# EAGLE design robot (EAGLE 6.5.0)
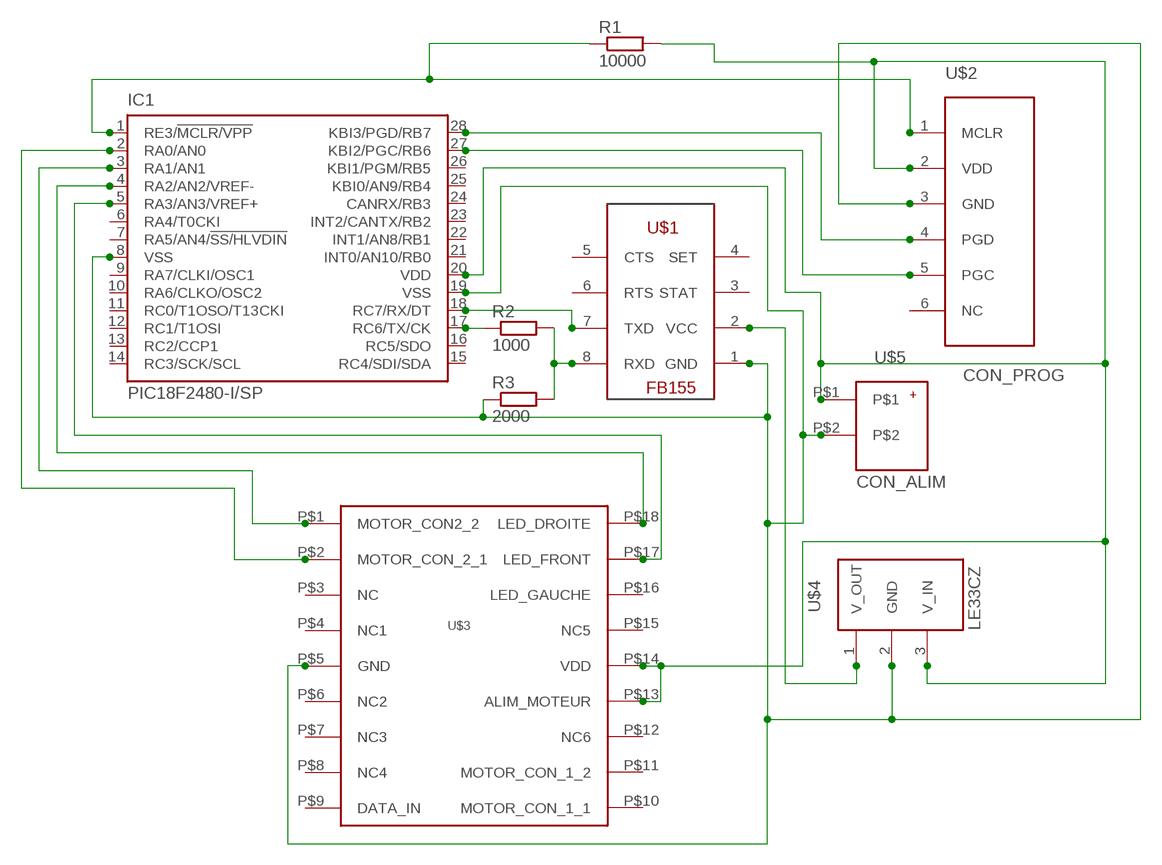
[diagram p0: schematic, sheet 1]

## Parts
IC1  PIC18F2480-I/SP  [DIL28-3]
R1  10000  R-EU_0207/7  [0207/7]
R2  1000  R-EU_0207/7  [0207/7]
R3  2000  R-EU_0207/7  [0207/7]
U$1  FB155  [DIL8L]
U$2  CON_PROG  [CON_PROG]
U$3  ROBOT  [CON_ROBOT]
U$4  LE33CZ  [T092]
U$5  CON_ALIM  [CON_ALIM]

## Nets
N$1: IC1.2(RA0/AN0) U$3.P$2(MOTOR_CON_2_1)
N$2: IC1.3(RA1/AN1) U$3.P$1(MOTOR_CON2_2)
N$3: IC1.4(RA2/AN2/VREF-) U$3.P$18(LED_DROITE)
N$4: IC1.5(RA3/AN3/VREF+) U$3.P$17(LED_FRONT)
N$5: IC1.28(KBI3/PGD/RB7) U$2.4(PGD)
N$6: IC1.27(KBI2/PGC/RB6) U$2.5(PGC)
N$7: IC1.17(RC6/TX/CK) R2.1
N$8: R2.2 R3.2 U$1.8(RXD)
N$9: U$1.2(VCC) U$4.1(V_OUT)
N$10: IC1.1(RE3/!MCLR/VPP) R1.1 U$2.1(MCLR)
N$11: IC1.8(VSS) IC1.19(VSS) R3.1 U$1.1(GND) U$2.3(GND) U$3.P$5(GND) U$4.2(GND) U$5.P$2
N$12: IC1.18(RC7/RX/DT) U$1.7(TXD)
N$15: IC1.20(VDD) R1.2 U$2.2(VDD) U$3.P$13(ALIM_MOTEUR) U$3.P$14(VDD) U$4.3(V_IN) U$5.P$1
Unconnected: IC1.6(RA4/T0CKI) IC1.7(RA5/AN4/!SS/HLVDIN) IC1.9(RA7/CLKI/OSC1) IC1.10(RA6/CLKO/OSC2) IC1.11(RC0/T1OSO/T13CKI) IC1.12(RC1/T1OSI) IC1.13(RC2/CCP1) IC1.14(RC3/SCK/SCL) IC1.15(RC4/SDI/SDA) IC1.16(RC5/SDO) IC1.21(INT0/AN10/RB0) IC1.22(INT1/AN8/RB1) IC1.23(INT2/CANTX/RB2) IC1.24(CANRX/RB3) IC1.25(KBI0/AN9/RB4) IC1.26(KBI1/PGM/RB5) U$1.3(STAT) U$1.4(SET) U$1.5(CTS) U$1.6(RTS) U$2.6(NC) U$3.P$3(NC) U$3.P$4(NC1) U$3.P$6(NC2) U$3.P$7(NC3) U$3.P$8(NC4) U$3.P$9(DATA_IN) U$3.P$10(MOTOR_CON_1_1) U$3.P$11(MOTOR_CON_1_2) U$3.P$12(NC6) U$3.P$15(NC5) U$3.P$16(LED_GAUCHE)

## Library data of the parts
IC1 = microchip:PIC18F2*80: 28-Pin Enhanced Flash Microcontrollers with ECAN(TM) Technology 10-Bit A/D and nanoWatt Technology Source: http://www.microchip.com .. 39637a.pdf; MF: MICROCHIP; MPN: PIC18F2480-I/SP; OC_FARNELL: 9321217; OC_NEWARK: 71J7237
R1-R3 = resistor:R-EU_: RESISTOR, European symbol
U$1 = FB155:FB155
U$2 = con_prog:CON_PROG
U$3 = robot:ROBOT
U$4 = regul:LE33CZ
U$5 = con_alim:CON_ALIM

## Board
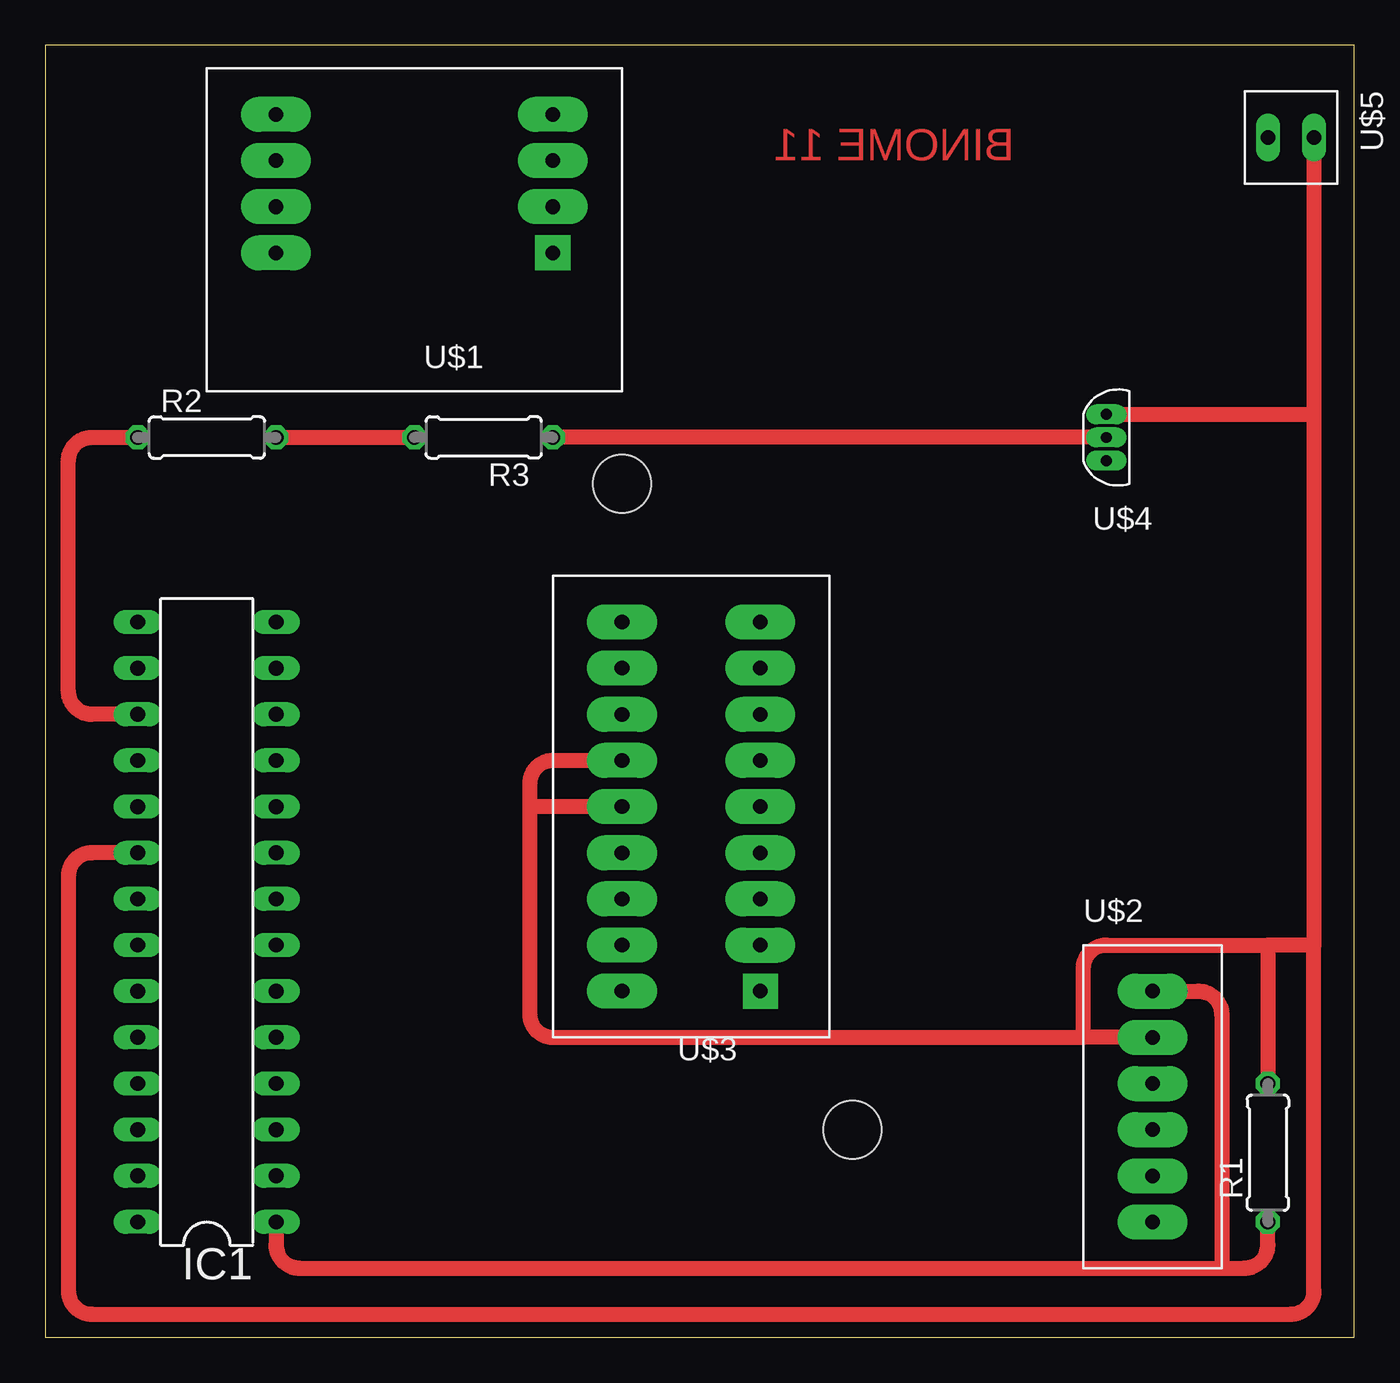
[diagram p1: board, top side]
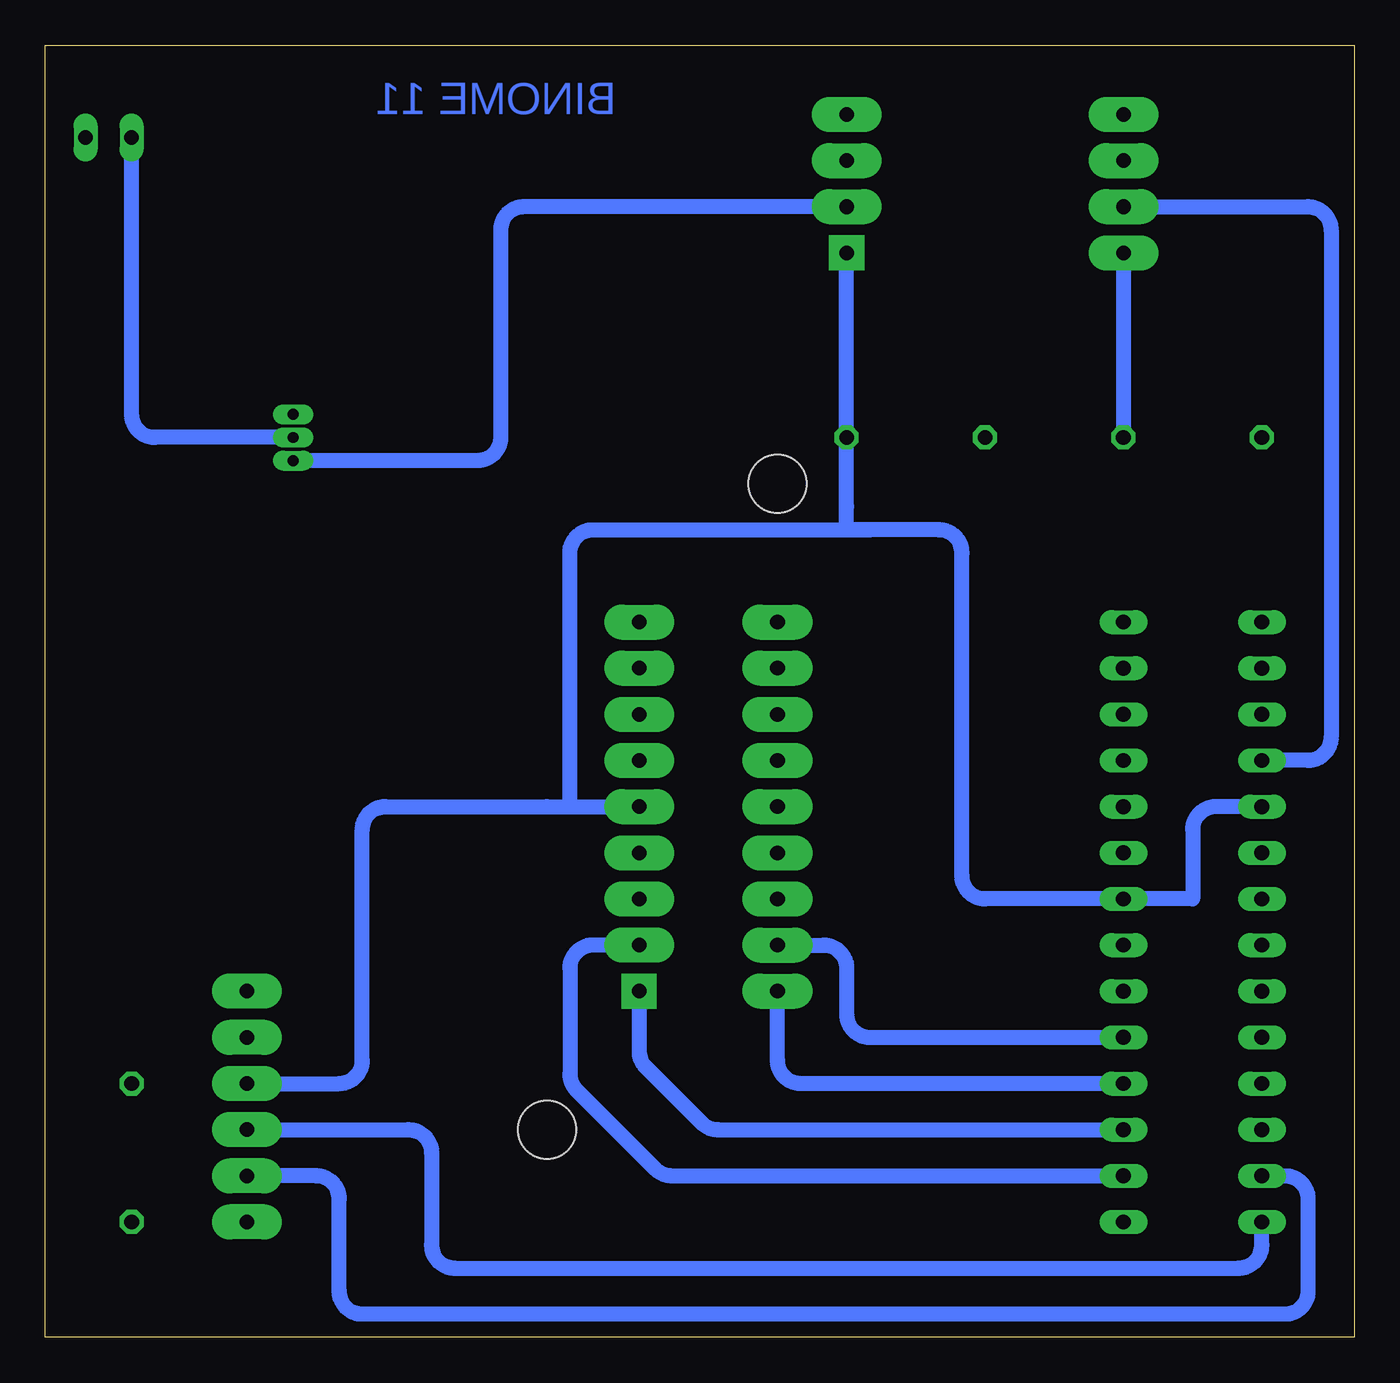
[diagram p2: board, bottom side, seen from below]

Size 72.06 x 71.11 mm. Coordinates in mm from the lower left corner, seen from the top.
Outline: 0,0 72.06,0 72.06,71.11 0,71.11 0,0
Copper layers (1*16): Top 0.035mm / dielectric 1.5mm / Bottom 0.035mm
Design rules "default": minimum track width 10mil, minimum drill 24mil, track to track 8mil, track to pad 8mil, pad to pad 8mil, via to via 8mil, smd to smd 8mil, copper to edge 40mil, drill to drill 8mil, minimum pad ring 10mil, minimum via ring 8mil, stop-mask expansion 4mil, vias tented up to drill 0mil, thermal gap 10mil
Holes 3.2 mm at 31.75,46.99 44.45,11.43

### Footprints (pad centres in the part's own frame; a part is rotated, then mirrored left to right if it is on the bottom)
DIL28-3 = drill 0.813 long: 1 -16.51,-3.81; 2 -13.97,-3.81; 3 -11.43,-3.81; 4 -8.89,-3.81; 5 -6.35,-3.81; 6 -3.81,-3.81; 7 -1.27,-3.81; 8 1.27,-3.81; 9 3.81,-3.81; 10 6.35,-3.81; 11 8.89,-3.81; 12 11.43,-3.81; 13 13.97,-3.81; 14 16.51,-3.81; 15 16.51,3.81; 16 13.97,3.81; 17 11.43,3.81; 18 8.89,3.81; 19 6.35,3.81; 20 3.81,3.81; 21 1.27,3.81; 22 -1.27,3.81; 23 -3.81,3.81; 24 -6.35,3.81; 25 -8.89,3.81; 26 -11.43,3.81; 27 -13.97,3.81; 28 -16.51,3.81
0207/7 = drill 0.813 octagon: 1 -3.81,0; 2 3.81,0
DIL8L = drill 0.8 pad 1.93 square: 1 -6.35,5.08 | drill 0.8 pad 1.93 long: 2 -6.35,2.54; 3 -6.35,0; 4 -6.35,-2.54; 5 8.89,-2.54; 6 8.89,0; 7 8.89,2.54; 8 8.89,5.08
CON_PROG = drill 0.8 pad 1.93 long: 1 1.27,3.81; 2 1.27,1.27; 3 1.27,-1.27; 4 1.27,-3.81; 5 1.27,-6.35; 6 1.27,-8.89
CON_ROBOT = drill 0.8 pad 1.93 square: P$1 -5.08,6.35 | drill 0.8 pad 1.93 long: P$2 -5.08,3.81; P$3 -5.08,1.27; P$4 -5.08,-1.27; P$5 -5.08,-3.81; P$6 -5.08,-6.35; P$7 -5.08,-8.89; P$8 -5.08,-11.43; P$9 -5.08,-13.97; P$10 2.54,-13.97; P$11 2.54,-11.43; P$12 2.54,-8.89; P$13 2.54,-6.35; P$14 2.54,-3.81; P$15 2.54,-1.27; P$16 2.54,1.27; P$17 2.54,3.81; P$18 2.54,6.35
T092 = drill 0.6 pad 0.813 long: 1 0,1.27; 2 0,0; 3 0,-1.27
CON_ALIM = drill 0.8 pad 1.016 long: P$1 -1.27,1.27; P$2 -1.27,-1.27

### Placement (x,y rotation side)
IC1  8.89,22.86 90 top
R1  67.31,10.16 90 top
R2  8.89,49.53 0 top
R3  24.13,49.53 180 top
U$1  21.59,64.77 180 top
U$2  59.69,15.24 0 top
U$3  34.29,25.4 180 top
U$4  58.42,49.53 180 top
U$5  68.58,64.77 270 top

### Tracks (layer width: path | path; a pad name or v marks a point on that pad's centre or on a via)
N$1
  Bottom 0.813: U$3.P$2 41.91,21.59 arc-90 43.18,20.32 43.18,14.5 arc-45 42.81,13.6 38.47,9.26 arc-45 37.57,8.89 IC1.2
N$2
  Bottom 0.813: U$3.P$1 39.37,15.77 arc-45 39,14.87 35.93,11.8 arc-45 35.03,11.43 IC1.3
N$3
  Bottom 0.813: IC1.4 30.48,13.97 arc90 31.75,15.24 U$3.P$18
N$4
  Bottom 0.813: U$3.P$17 29.21,21.59 arc90 27.94,20.32 27.94,17.78 arc-90 26.67,16.51 IC1.5
N$5
  Bottom 0.813: U$2.4 52.07,11.43 arc90 50.8,10.16 50.8,5.08 arc-90 49.53,3.81 6.35,3.81 arc-90 5.08,5.08 IC1.28
N$6
  Bottom 0.813: IC1.27 3.81,8.89 arc90 2.54,7.62 2.54,2.54 arc90 3.81,1.27 54.61,1.27 arc90 55.88,2.54 55.88,7.62 arc-90 57.15,8.89 U$2.5
N$7
  Top 0.813: IC1.17 2.54,34.29 arc-90 1.27,35.56 1.27,48.26 arc-90 2.54,49.53 R2.1
N$8
  Top 0.813: R2.2 R3.2
  Bottom 0.813: U$1.8 R2.2
N$9
  Bottom 0.813: U$1.2 45.72,62.23 arc-90 46.99,60.96 46.99,49.53 arc90 48.26,48.26 U$4.1
N$10
  Top 0.813: IC1.1 12.7,5.08 arc90 13.97,3.81 64.77,3.81 | 64.77,3.81 66.04,3.81 arc90 67.31,5.08 R1.1 | U$2.1 63.5,19.05 arc-90 64.77,17.78 64.77,3.81
N$11
  Top 0.813: U$4.2 R3.1
  Bottom 0.813: U$1.1 R3.1 27.94,45.72 27.94,44.45 26.67,44.45 | IC1.19 7.62,29.21 arc-90 8.89,27.94 8.89,24.13 IC1.8 20.32,24.13 arc90 21.59,25.4 21.59,43.18 arc-90 22.86,44.45 26.67,44.45 | U$2.3 55.88,13.97 arc-90 54.61,15.24 54.61,27.94 arc90 53.34,29.21 44.45,29.21 | 44.45,29.21 U$3.P$5 | 44.45,29.21 43.18,29.21 43.18,30.48 43.18,43.18 arc90 41.91,44.45 26.67,44.45 | U$4.2 66.04,49.53 arc90 67.31,50.8 U$5.P$2
N$12
  Bottom 0.813: U$1.7 2.54,62.23 arc90 1.27,60.96 1.27,33.02 arc90 2.54,31.75 IC1.18
N$13  (via drill 0.6)
  other vias: 31.75,46.99
N$14  (via drill 0.6)
  other vias: 44.45,11.43
N$15
  Top 0.813: U$5.P$1 69.85,50.8 | 69.85,50.8 69.85,21.59 | 69.85,21.59 67.31,21.59 | 67.31,21.59 R1.2 | U$2.2 57.15,16.51 | 57.15,16.51 57.15,20.32 arc-90 58.42,21.59 67.31,21.59 | 26.67,29.21 26.67,30.48 arc-90 27.94,31.75 U$3.P$13 | 26.67,29.21 26.67,17.78 arc90 27.94,16.51 57.15,16.51 | IC1.20 2.54,26.67 arc90 1.27,25.4 1.27,2.54 arc90 2.54,1.27 68.58,1.27 arc90 69.85,2.54 69.85,21.59 | U$4.3 69.85,50.8 | U$3.P$14 26.67,29.21

### Text on the board
Top: BINOME 11
Bottom: BINOME 11